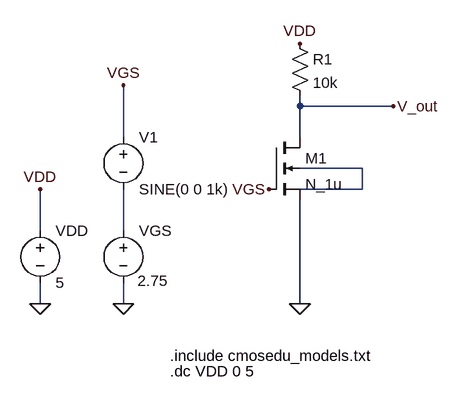
[diagram p0: schematic Draft1.asc]
Draft1.asc, the LTspice schematic file:
Version 4
SHEET 1 880 680
WIRE 192 96 192 80
WIRE 336 96 192 96
WIRE -80 144 -80 64
WIRE 192 144 192 96
WIRE 288 192 192 192
WIRE 288 224 288 192
WIRE 288 224 192 224
WIRE -208 288 -208 224
WIRE -80 288 -80 224
WIRE -208 400 -208 368
WIRE -80 400 -80 368
WIRE 192 400 192 240
FLAG -80 400 0
FLAG 192 400 0
FLAG -208 400 0
FLAG -208 224 VDD
FLAG 192 0 VDD
FLAG 336 96 V_out
FLAG -80 64 VGS
FLAG 144 224 VGS
SYMBOL res 176 -16 R0
SYMATTR InstName R1
SYMATTR Value 10k
SYMBOL voltage -80 272 R0
WINDOW 123 0 0 Left 2
WINDOW 39 0 0 Left 2
WINDOW 3 22 93 Left 2
SYMATTR Value 2.75
SYMATTR InstName VGS
SYMBOL nmos4 144 144 R0
SYMATTR InstName M1
SYMATTR Value N_1u
SYMATTR Value2 l=1.5u w=3.5u
SYMBOL voltage -208 272 R0
WINDOW 123 0 0 Left 2
WINDOW 39 0 0 Left 2
SYMATTR InstName VDD
SYMATTR Value 5
SYMBOL voltage -80 128 R0
WINDOW 123 0 0 Left 2
WINDOW 39 0 0 Left 2
SYMATTR InstName V1
SYMATTR Value SINE(0 0 1k)
TEXT -8 480 Left 2 !.include cmosedu_models.txt
TEXT -8 504 Left 2 !.dc VDD 0 5

The netlist it stands for:
* Draft1.asc
R1 VDD V_out 10k
VGS N002 0 2.75
M1 V_out VGS 0 N001 N_1u l=1.5u w=3.5u
VDD VDD 0 5
V1 VGS N002 SINE(0 0 1k)
.model NMOS NMOS
.model PMOS PMOS
.lib standard.mos
.include cmosedu_models.txt
.dc VDD 0 5
.backanno
.end